# EAGLE design LCD_board (EAGLE 7.1.0)
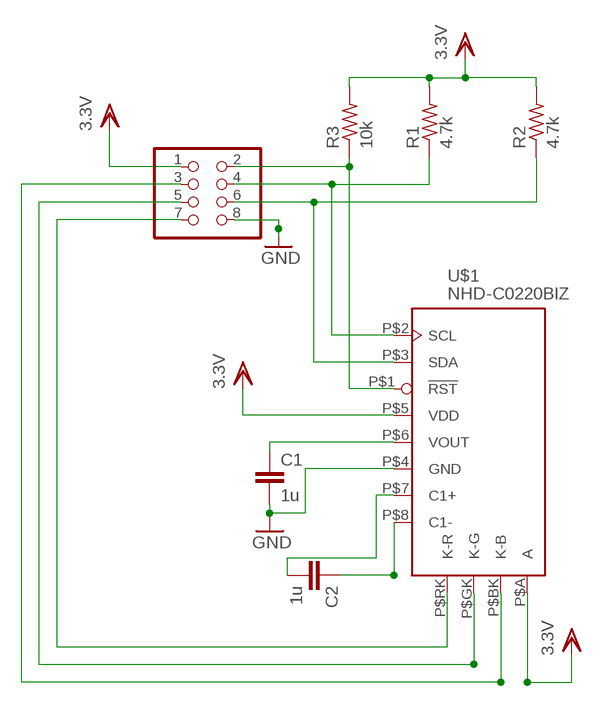
[diagram p0: schematic, sheet 1]

## Parts
C1  1u  C  [C0805]
C2  1u  C  [C0805]
DATALINES  To MPU  PINHD-2X4  [2X04]
R1  4.7k  R-US_M0805  [M0805]
R2  4.7k  R-US_M0805  [M0805]
R3  10k  R-US_M0805  [M0805]
U$1  NHD-C0220BIZ  [NHD-C0220BIZ-LCD]

## Nets
3.3V: DATALINES.1 R1.2 R2.2 R3.2 U$1.P$5(VDD) U$1.P$A(A)
!LCD_RST: DATALINES.2 R3.1 U$1.P$1(!RST)
C1+: C2.2 U$1.P$7(C1+)
EN_BL: DATALINES.3 U$1.P$BK(K-B)
EN_G: DATALINES.5 U$1.P$GK(K-G)
EN_RD: DATALINES.7 U$1.P$RK(K-R)
GND: C1.2 DATALINES.8 U$1.P$4(GND)
N$1: C2.1 U$1.P$8(C1-)
N$5: C1.1 U$1.P$6(VOUT)
SCL: DATALINES.4 R1.1 U$1.P$2(SCL)
SDA: DATALINES.6 R2.1 U$1.P$3(SDA)

## Library data of the parts
C1 C2 = T06_LockBox:C: CAPACITOR, European symbol; SPICEMODEL: NONE; SPICEPREFIX: C
DATALINES = T06_LockBox:PINHD-2X4: PIN HEADER
R1-R3 = T06_LockBox:R-US_: RESISTOR, American symbol
U$1 = T06_LockBox:NHD-C0220BIZ: NHD-C0220Biz - Character Liquid Crystal DIsplay Module Source: http://www.newhavendisplay.com/specs/NHD-C0220BiZ-FSRGB-FBW-3VM.pdf; COG: 2x20; INTERFACE: I2C; VOLTS: 3.3V

## Board
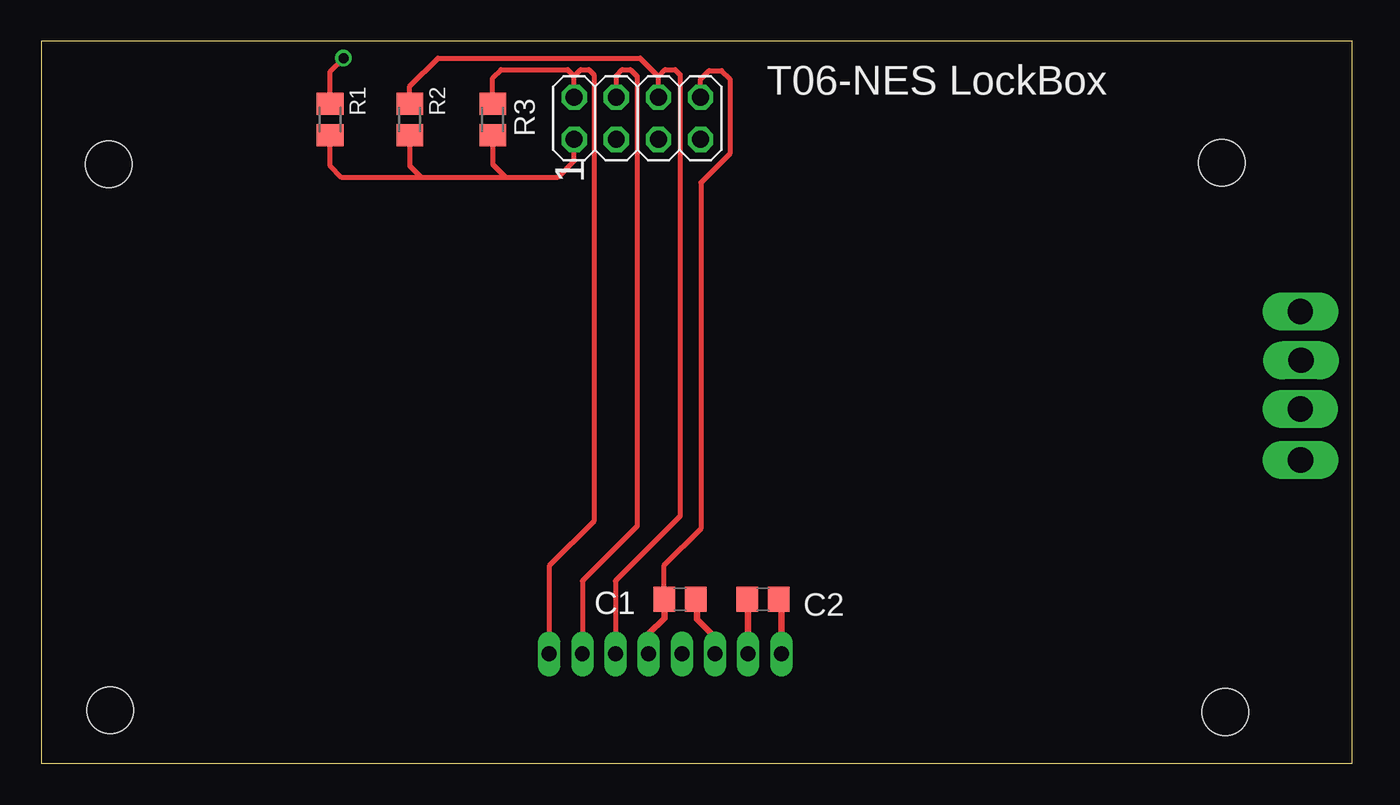
[diagram p1: board, top side]
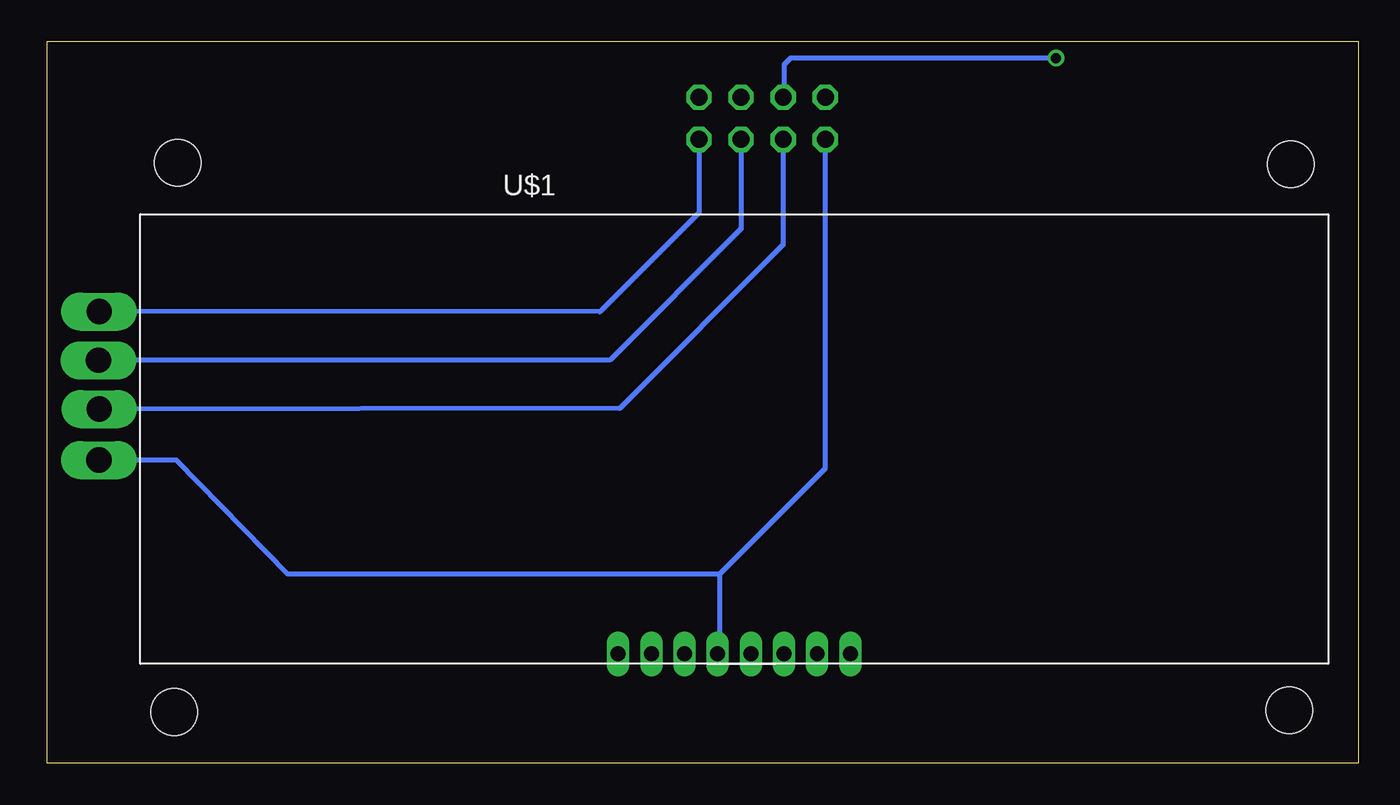
[diagram p2: board, bottom side, seen from below]

Size 79 x 43.5 mm. Coordinates in mm from the lower left corner, seen from the top.
Outline: 0,0 79,0 79,43.5 0,43.5 0,0
Copper layers (1*16): Top 0.0178mm / dielectric 59mil / Bottom 0.0178mm
Design rules "epl-lpkf": minimum track width 8mil, minimum drill 0.35mm, track to track 8mil, track to pad 8mil, pad to pad 8mil, via to via 8mil, smd to smd 8mil, copper to edge 15mil, drill to drill 15mil, minimum pad ring 8mil, minimum via ring 8mil, stop-mask expansion 3mil, vias tented up to drill 0mil, thermal gap 10mil

### Footprints (pad centres in the part's own frame; a part is rotated, then mirrored left to right if it is on the bottom)
C0805 = smd 1.3 x 1.5: 1 -0.95,0; 2 0.95,0
2X04 = drill 1.016 octagon: 1 -3.81,-1.27; 2 -3.81,1.27; 3 -1.27,-1.27; 4 -1.27,1.27; 5 1.27,-1.27; 6 1.27,1.27; 7 3.81,-1.27; 8 3.81,1.27
M0805 = smd 1.3 x 1.6: 1 -0.95,0; 2 0.95,0
NHD-C0220BIZ-LCD = drill 0.9 long: P$1 7,-16.2; P$2 5,-16.2; P$3 3,-16.2; P$4 1,-16.2; P$5 -1,-16.2; P$6 -3,-16.2; P$7 -5,-16.2; P$8 -7,-16.2 | drill 1.524 long: P$A -38.286,-4.52; P$BK -38.278,-1.45; P$GK -38.33,1.49; P$RK -38.282,4.43 | hole 2.8: 33.45,-19.6; 33.55,13.3; -33.55,13.4; -33.75,-19.7

### Placement (x,y rotation side)
C1  38.5,9.9 180 top
C2  43.5,9.9 180 top
DATALINES  35.92,38.87 0 top
R1  17.4,38.8 270 top
R2  22.2,38.8 270 top
R3  27.2,38.8 270 top
U$1  37.6,22.8 0 bottom

### Tracks (layer width: path | path; a pad name or v marks a point on that pad's centre or on a via)
3.3V
  Top 0.305: 28,35.3 31.1,35.3 32.11,36.31 DATALINES.1 | 28,35.3 22.9,35.3 | 22.9,35.3 18.1,35.3 17.4,36 R1.2 | R3.2 27.2,36.1 28,35.3 | R2.2 22.2,36 22.9,35.3
  Bottom 0.305: 38.5,11.4 32.11,17.79 DATALINES.1 | 38.5,11.4 38.5,6.7 U$1.P$5 | 38.5,11.4 64.5,11.4 71.22,18.28 U$1.P$A
!LCD_RST
  Top 0.305: DATALINES.2 32.11,41.41 | 32.11,41.41 32.5,41.8 33,41.8 33.3,41.5 33.3,14.6 30.6,11.9 U$1.P$1 | R3.1 27.2,41.3 27.7,41.8 31.72,41.8 32.11,41.41
C1+
  Top 0.406: C2.2 42.6,9.9 U$1.P$7
EN_BL
  Bottom 0.305: DATALINES.3 34.65,31.25 44.5,21.4 75.79,21.34 U$1.P$BK
EN_G
  Bottom 0.305: DATALINES.5 37.19,32.21 45.1,24.3 U$1.P$GK
EN_RD
  Bottom 0.305: DATALINES.7 39.73,33.17 45.7,27.2 75.83,27.24 U$1.P$RK
GND
  Top 0.305: DATALINES.8 39.73,41.23 40.25,41.75 41,41.75 41.5,41.25 41.5,36.75 39.75,35 39.75,14.15 37.5,11.9 37.5,9.95 C1.2
  Top 0.406: C1.2 37.55,8.75 36.6,7.8 U$1.P$4
N$1
  Top 0.406: C2.1 44.6,9.9 U$1.P$8
N$5
  Top 0.406: U$1.P$6 40.6,7.6 39.5,8.7 39.5,9.85 C1.1
SCL  (via drill 0.6)
  Top 0.305: DATALINES.4 34.65,41.45 35,41.8 35.5,41.8 35.9,41.4 35.9,14.3 32.6,11 U$1.P$2 | R1.1 17.4,41.7 v18.2,42.5
  Bottom 0.305: v18.2,42.5 34.2,42.5 34.6,42.1 34.6,40.19 DATALINES.4
SDA
  Top 0.305: DATALINES.6 37.19,41.39 | 37.19,41.39 37.6,41.8 38.2,41.8 38.5,41.5 38.5,14.9 34.6,11 U$1.P$3 | R2.1 22.2,40.8 23.9,42.5 36.08,42.5 37.19,41.39

### Text on the board
tPlace: T06-NES LockBox | 1